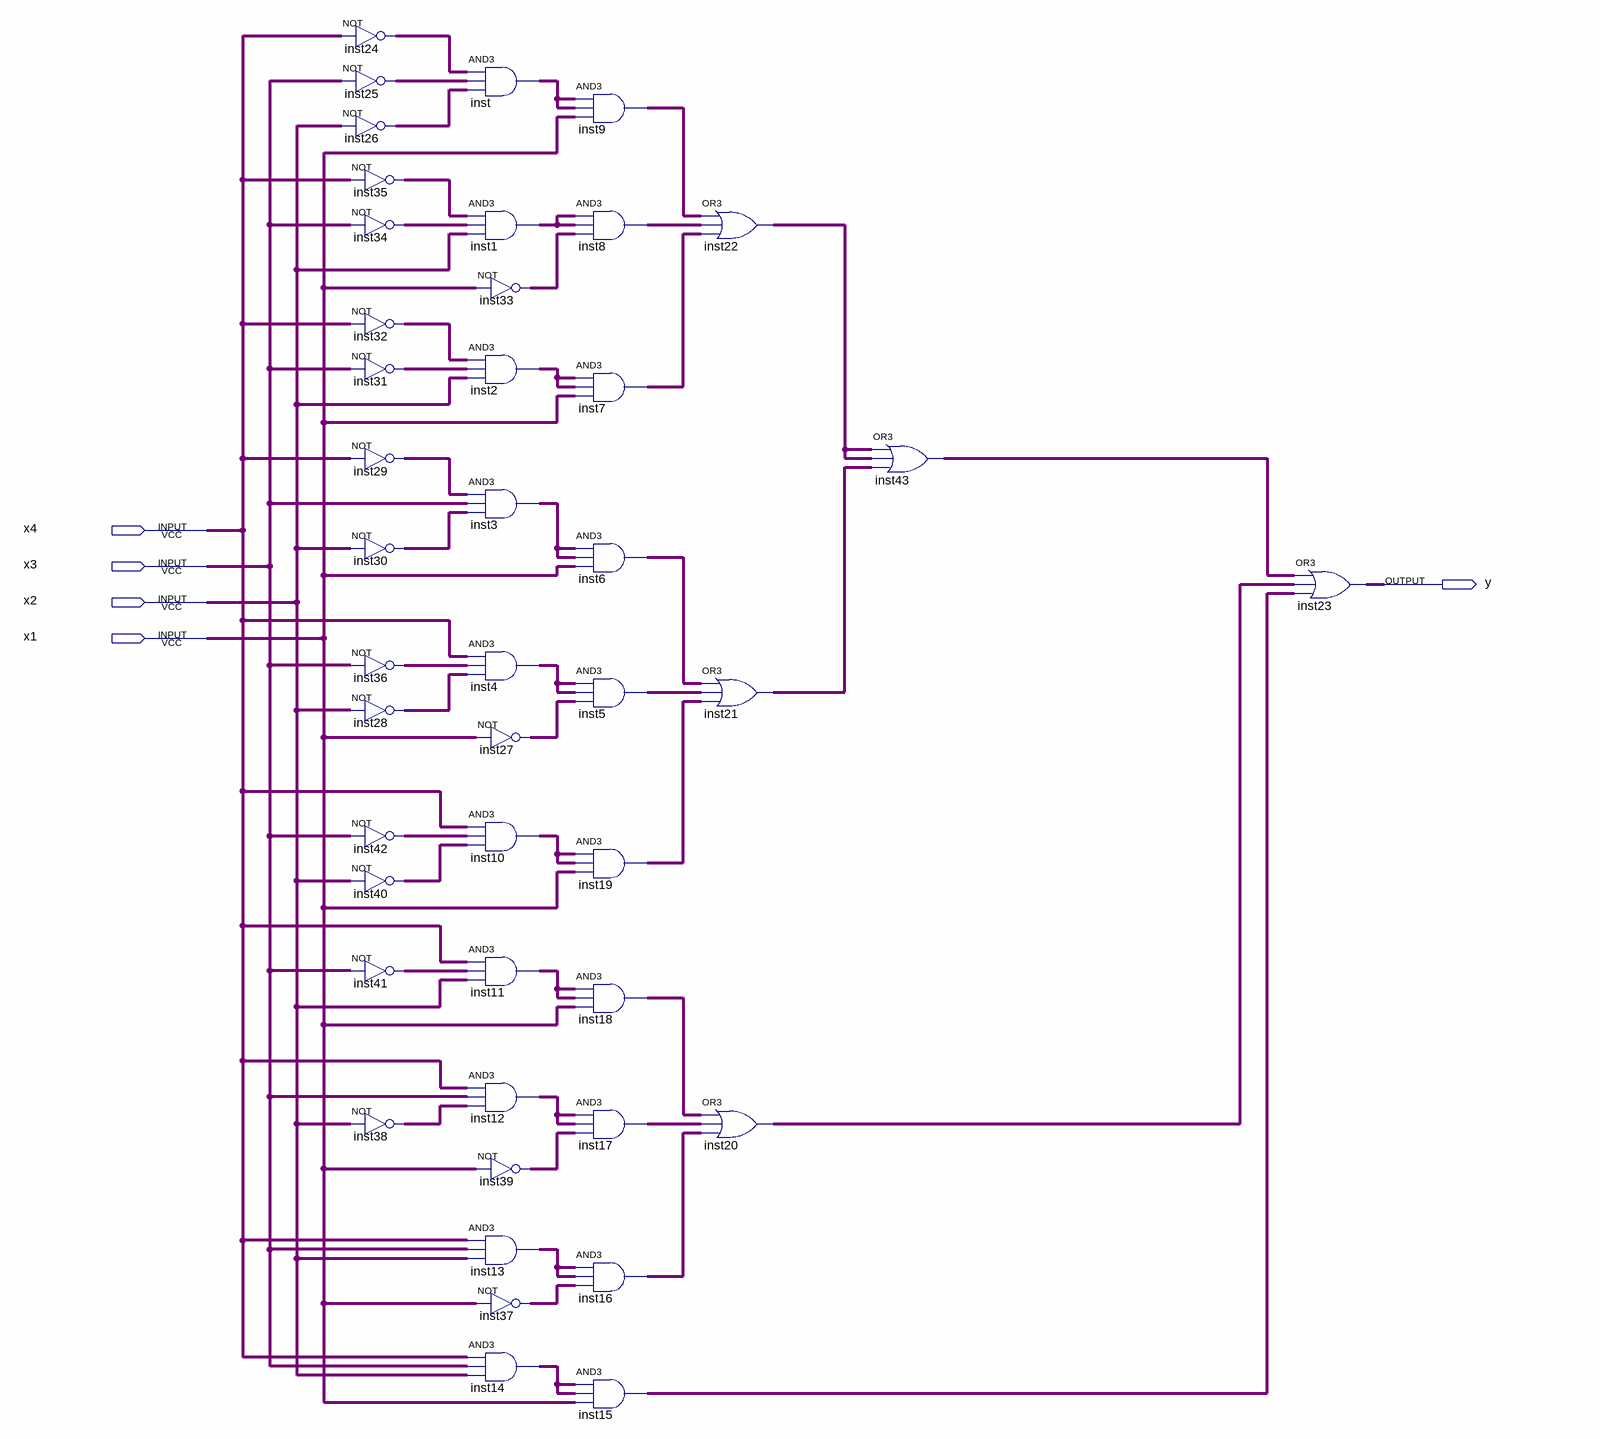
[diagram p0: schematic sheet]
// Quartus schematic LC1.bdf as structural Verilog: 44 symbols, 5 pins
module LC1 (
  input  x4,
  input  x3,
  input  x2,
  input  x1,
  output y
);

  wire inst1_out, inst2_out, inst3_out, inst4_out, inst5_out, inst6_out, inst7_out, inst8_out, inst9_out,
       inst10_out, inst11_out, inst12_out, inst13_out, inst14_out, inst15_out, inst16_out, inst17_out,
       inst18_out, inst19_out, inst20_out, inst21_out, inst22_out, inst24_out, inst25_out, inst26_out,
       inst27_out, inst28_out, inst29_out, inst30_out, inst31_out, inst32_out, inst33_out, inst34_out,
       inst35_out, inst36_out, inst37_out, inst38_out, inst39_out, inst40_out, inst41_out, inst42_out,
       inst43_out, inst_out;

  not inst24 (inst24_out, x4);
  not inst25 (inst25_out, x3);
  not inst26 (inst26_out, x2);
  not inst35 (inst35_out, x4);
  not inst34 (inst34_out, x3);
  not inst32 (inst32_out, x4);
  not inst31 (inst31_out, x3);
  not inst29 (inst29_out, x4);
  not inst30 (inst30_out, x2);
  not inst36 (inst36_out, x3);
  not inst28 (inst28_out, x2);
  not inst42 (inst42_out, x3);
  not inst40 (inst40_out, x2);
  not inst41 (inst41_out, x3);
  not inst38 (inst38_out, x2);
  and inst (inst_out, inst24_out, inst25_out, inst26_out);
  and inst1 (inst1_out, inst35_out, inst34_out, x2);
  and inst2 (inst2_out, inst32_out, inst31_out, x2);
  and inst3 (inst3_out, inst29_out, x3, inst30_out);
  and inst4 (inst4_out, x4, inst36_out, inst28_out);
  and inst10 (inst10_out, x4, inst42_out, inst40_out);
  and inst11 (inst11_out, x4, inst41_out, x2);
  and inst12 (inst12_out, x4, x3, inst38_out);
  and inst13 (inst13_out, x4, x3, x2);
  and inst14 (inst14_out, x4, x3, x2);
  not inst33 (inst33_out, x1);
  not inst27 (inst27_out, x1);
  not inst39 (inst39_out, x1);
  not inst37 (inst37_out, x1);
  and inst9 (inst9_out, inst_out, inst_out, x1);
  and inst8 (inst8_out, inst1_out, inst1_out, inst33_out);
  and inst7 (inst7_out, inst2_out, inst2_out, x1);
  and inst6 (inst6_out, inst3_out, inst3_out, x1);
  and inst5 (inst5_out, inst4_out, inst4_out, inst27_out);
  and inst19 (inst19_out, inst10_out, inst10_out, x1);
  and inst18 (inst18_out, inst11_out, inst11_out, x1);
  and inst17 (inst17_out, inst12_out, inst12_out, inst39_out);
  and inst16 (inst16_out, inst13_out, inst13_out, inst37_out);
  and inst15 (inst15_out, inst14_out, inst14_out, x1);
  or inst22 (inst22_out, inst9_out, inst8_out, inst7_out);
  or inst21 (inst21_out, inst6_out, inst5_out, inst19_out);
  or inst20 (inst20_out, inst18_out, inst17_out, inst16_out);
  or inst43 (inst43_out, inst22_out, inst22_out, inst21_out);
  or inst23 (y, inst43_out, inst20_out, inst15_out);
endmodule
